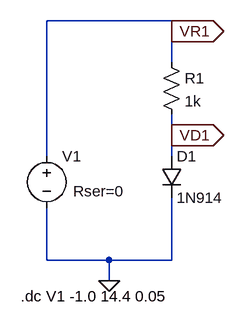
[diagram p0: schematic 1N914_R1.asc]
1N914_R1.asc, the LTspice schematic file:
Version 4
SHEET 1 880 680
WIRE 256 -64 64 -64
WIRE 256 -48 256 -64
WIRE 256 0 256 -48
WIRE 256 112 256 80
WIRE 64 144 64 -64
WIRE 256 144 256 112
WIRE 64 304 64 224
WIRE 160 304 64 304
WIRE 256 304 256 208
WIRE 256 304 160 304
WIRE 160 336 160 304
FLAG 160 336 0
FLAG 256 -48 VR1
IOPIN 256 -48 Out
FLAG 256 112 VD1
IOPIN 256 112 Out
SYMBOL voltage 64 128 R0
WINDOW 3 41 42 Left 2
WINDOW 123 0 0 Left 0
WINDOW 39 41 70 Left 2
SYMATTR Value ""
SYMATTR SpiceLine Rser=0
SYMATTR InstName V1
SYMBOL diode 240 144 R0
SYMATTR InstName D1
SYMATTR Value 1N914
SYMBOL res 240 -16 R0
SYMATTR InstName R1
SYMATTR Value 1k
TEXT 24 360 Left 2 !.dc V1 -1.0 14.4 0.05

The netlist it stands for:
* 1N914_R1.asc
V1 VR1 0 Rser=0
D1 VD1 0 1N914
R1 VR1 VD1 1k
.model D D
.lib standard.dio
.dc V1 -1.0 14.4 0.05
.backanno
.end